# EAGLE design tweety (EAGLE 7.2.0)
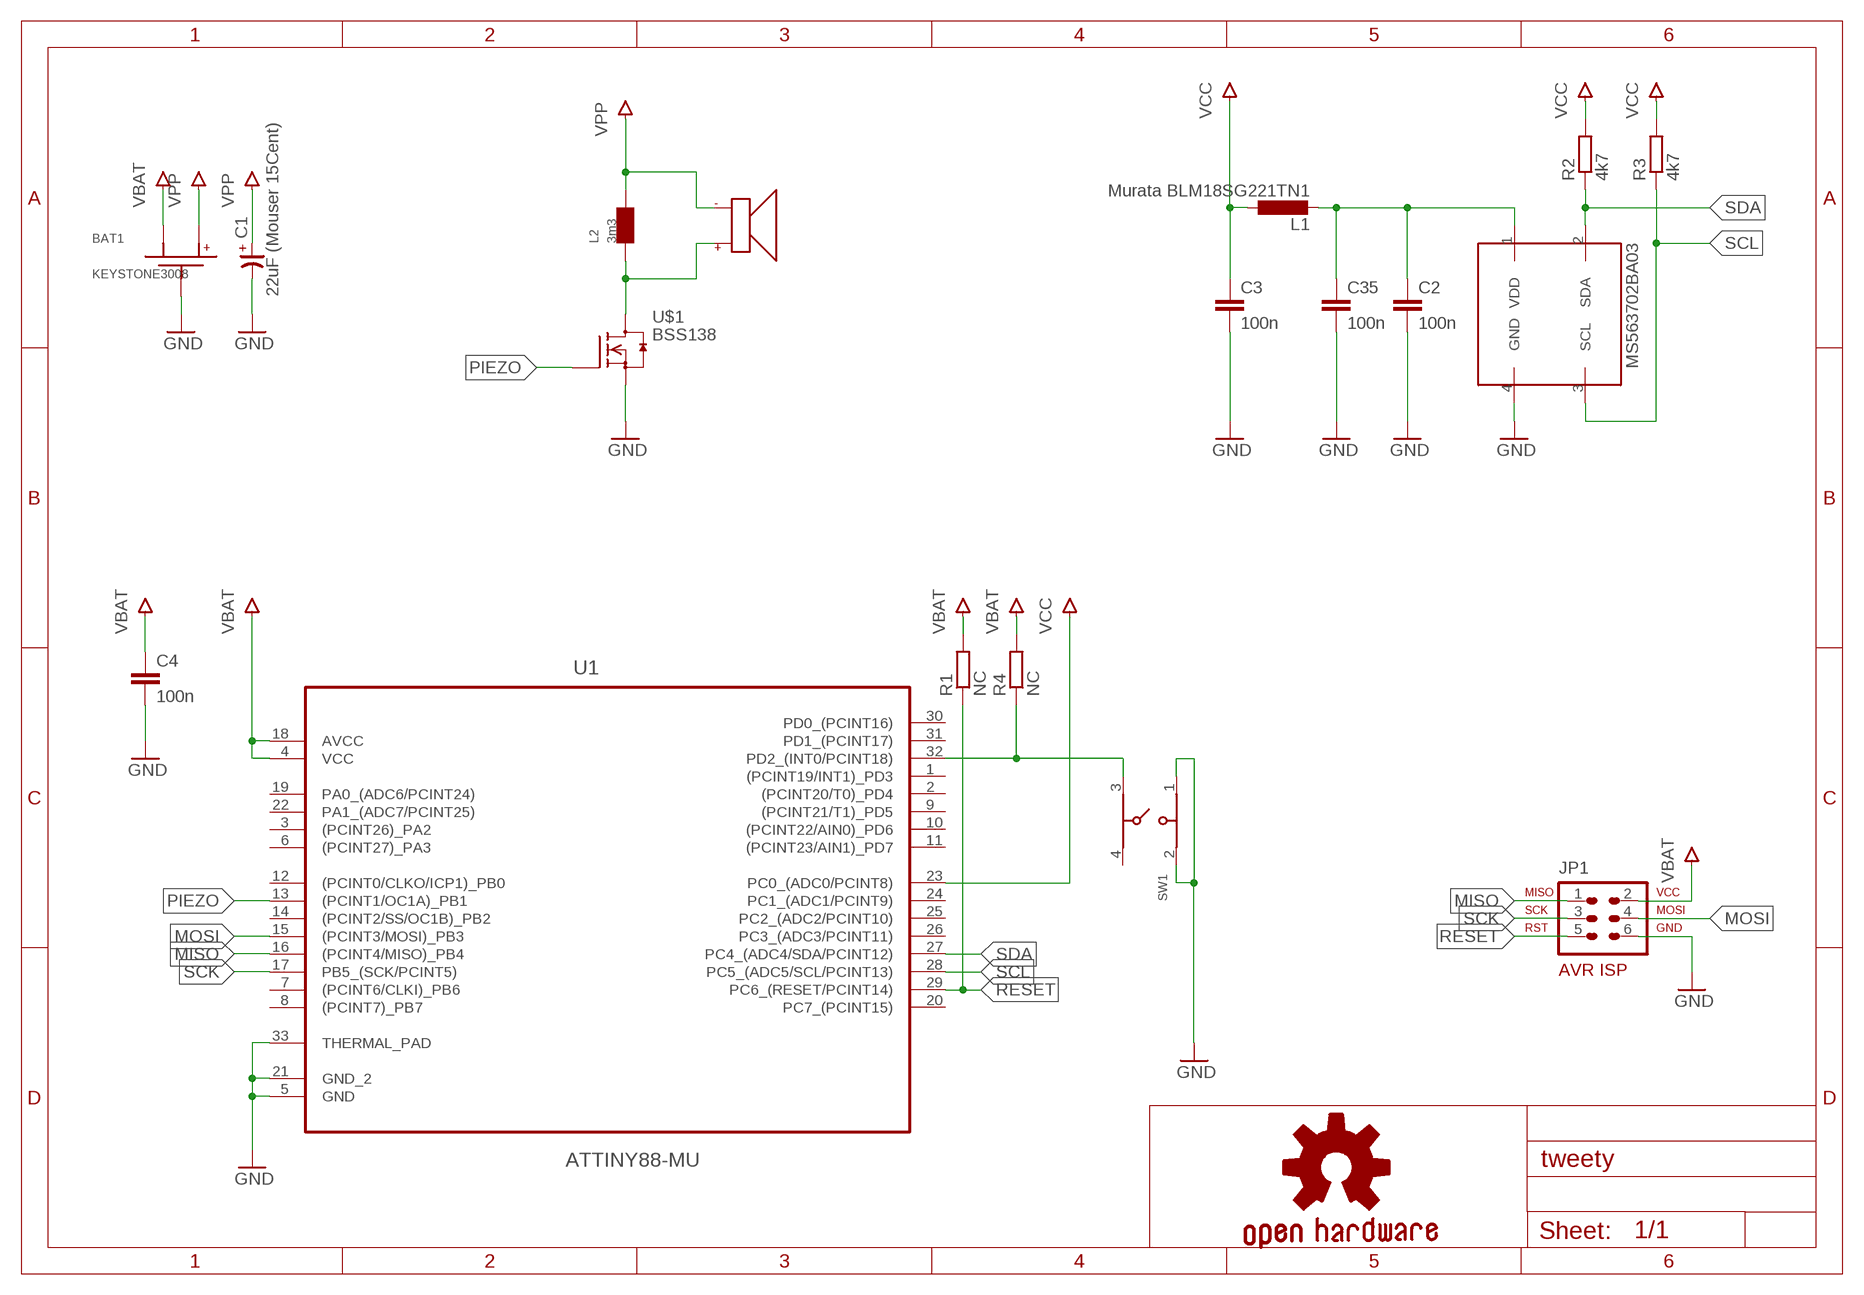
[diagram p0: schematic, sheet 1]

## Parts
BAT1  KEYSTONE3008  [KEYSTONE3008]
C1  22uF (Mouser 15Cent)  CP-3528-21R  [3528-21R/T]
C2  100n  C-EUC0603  [C0603]
C3  100n  C-EUC0603  [C0603]
C4  100n  C-EUC0603  [C0603]
C35  100n  C-EUC0603  [C0603]
GOLD_ORB_SM1  OSHWLOGO_GOLD_ORB_MED  [OSHW1]
IC2  MS563702BA03  [MS5637]
JP1  AVR-ISP-6VERT  [AVR-ISP-6]
L1  Murata BLM18SG221TN1  L-EUL0603  [L0603]
L2  3m3  SDR0503  [SDR0503]
P2  PKLCS1212E2400  [PKLCS1212]
R1  NC  R-EU_R0603  [R0603]
R2  4k7  R-EU_R0603  [R0603]
R3  4k7  R-EU_R0603  [R0603]
R4  NC  R-EU_R0603  [R0603]
SW1  4301X20858X6  [4301X20858X6]
U1  ATTINY88-MU  [QFN50P500X500X100-33N]
U$1  BSS138  [SOT23]

## Nets
GND: BAT1.N C1.- C2.2 C3.2 C4.2 C35.2 IC2.4(GND) JP1.6 SW1.1 SW1.2 U1.5(GND) U1.21(GND_2) U1.33(THERMAL_PAD) U$1.2(S)
MISO: JP1.1 U1.16((PCINT4/MISO)_PB4)
MOSI: JP1.4 U1.15((PCINT3/MOSI)_PB3)
N$1: C2.1 C35.1 IC2.1(VDD) L1.2
N$2: R4.1 SW1.3 U1.32(PD2_(INT0/PCINT18))
N$3: L2.P$1 P2.P$+ U$1.3(D)
PIEZO: U1.13((PCINT1/OC1A)_PB1) U$1.1(G)
RESET: JP1.5 R1.1 U1.29(PC6_(RESET/PCINT14))
SCK: JP1.3 U1.17(PB5_(SCK/PCINT5))
SCL: IC2.3(SCL) R3.1 U1.28(PC5_(ADC5/SCL/PCINT13))
SDA: IC2.2(SDA) R2.1 U1.27(PC4_(ADC4/SDA/PCINT12))
VBAT: BAT1.P$3(P1) C4.1 JP1.2 R1.2 R4.2 U1.4(VCC) U1.18(AVCC)
VCC: C3.1 L1.1 R2.2 R3.2 U1.23(PC0_(ADC0/PCINT8))
VPP: BAT1.P$4(P2) C1.+ L2.P$2 P2.P$-
Unconnected: SW1.4 U1.1((PCINT19/INT1)_PD3) U1.2((PCINT20/T0)_PD4) U1.3((PCINT26)_PA2) U1.6((PCINT27)_PA3) U1.7((PCINT6/CLKI)_PB6) U1.8((PCINT7)_PB7) U1.9((PCINT21/T1)_PD5) U1.10((PCINT22/AIN0)_PD6) U1.11((PCINT23/AIN1)_PD7) U1.12((PCINT0/CLKO/ICP1)_PB0) U1.14((PCINT2/SS/OC1B)_PB2) U1.19(PA0_(ADC6/PCINT24)) U1.20(PC7_(PCINT15)) U1.22(PA1_(ADC7/PCINT25)) U1.24(PC1_(ADC1/PCINT9)) U1.25(PC2_(ADC2/PCINT10)) U1.26(PC3_(ADC3/PCINT11)) U1.30(PD0_(PCINT16)) U1.31(PD1_(PCINT17))

## Library data of the parts
BAT1 = vario_spc:KEYSTONE3008
C1 = cap-master:CP-: POLARIZED CAP
C2-C4 C35 = rcl-2:C-EU: CAPACITOR, European symbol
GOLD_ORB_SM1 = bfl:OSHWLOGO: These are Open-Source Hardware logos.
IC2 = freetronics-original:MS5637
JP1 = avr-7:AVR-ISP-6: AVR ISP-6 Serial Programming Header
L1 = rcl-2:L-EU: INDUCTOR, European symbol
L2 = vario_spc:SDR0503
P2 = vario_spc:PKLCS1212E2400
R1-R4 = rcl-2:R-EU_: RESISTOR, European symbol
SW1 = EAGLE-TACT_SWITCHES-rev1:4301X20858X6: WS-TASV Tact Switch, SMD version Specification Contact Rating Switching :50mA, 12VDC Contact Resistance Initial: 100mΩ max. After life test: 2mΩ max. Insulation Resistance: min.100MΩ at 500VDC Dielectric Strength : 250VAC for 1 minute Stroke :0.3 ± 0.1mm. Bounce : 10ms max. Material Cover : : Stainless Steel Stem :PA9T UL 94 V-0. Frame :PA9T UL 94 V-0, color Black Contact : :Stainless Steel with Silver Terminal : Copper Alloy with Silver <http://katalog.we-online.de/media/images/v2/Family_WS-TASV-Gruppe.jpg> Details see: http://katalog.we-online.de/en/em/TASV_12X12_SMD 2015 (C) Wurth Elektronik
U1 = vario_spc:ATTINY88-MU: IC, 8BIT MCU, AVR Tiny, 12MHZ, QFN-32; MPN: ATTINY88-MU; OC_FARNELL: 1748549; OC_NEWARK: 68T3857; PACKAGE: QFN-32; SUPPLIER: ATMEL
U$1 = m-pad-1.5:BSS138: Fairchild Semiconductors BSS138 N-Channel Logic Level Enhancement Mode Field Effect Transistor General Description: These N-Channel enhancement mode field effect transistors are produced using Fairchild?s proprietary, high cell density, DMOS technology. These products have been designed to minimize on-state resistance while provide rugged, reliable, and fast switching performance.These products are particularly suited for low voltage, low current applications such as small servo motor control, power MOSFET gate drivers, and other switching applications. Features: 0.22 A, 50 V. RDS(ON) = 3.5? @ VGS = 10 V RDS(ON) = 6.0? @ VGS = 4.5 V High density cell design for extremely low RDS(ON) Rugged and Reliable Compact industry standard SOT-23 surface mount package Please send any comments to: messi@users.sourceforge.net

## Net classes
0 default: width 0.152 mm, drill 0.305 mm, clearance 0.152 mm

## Board
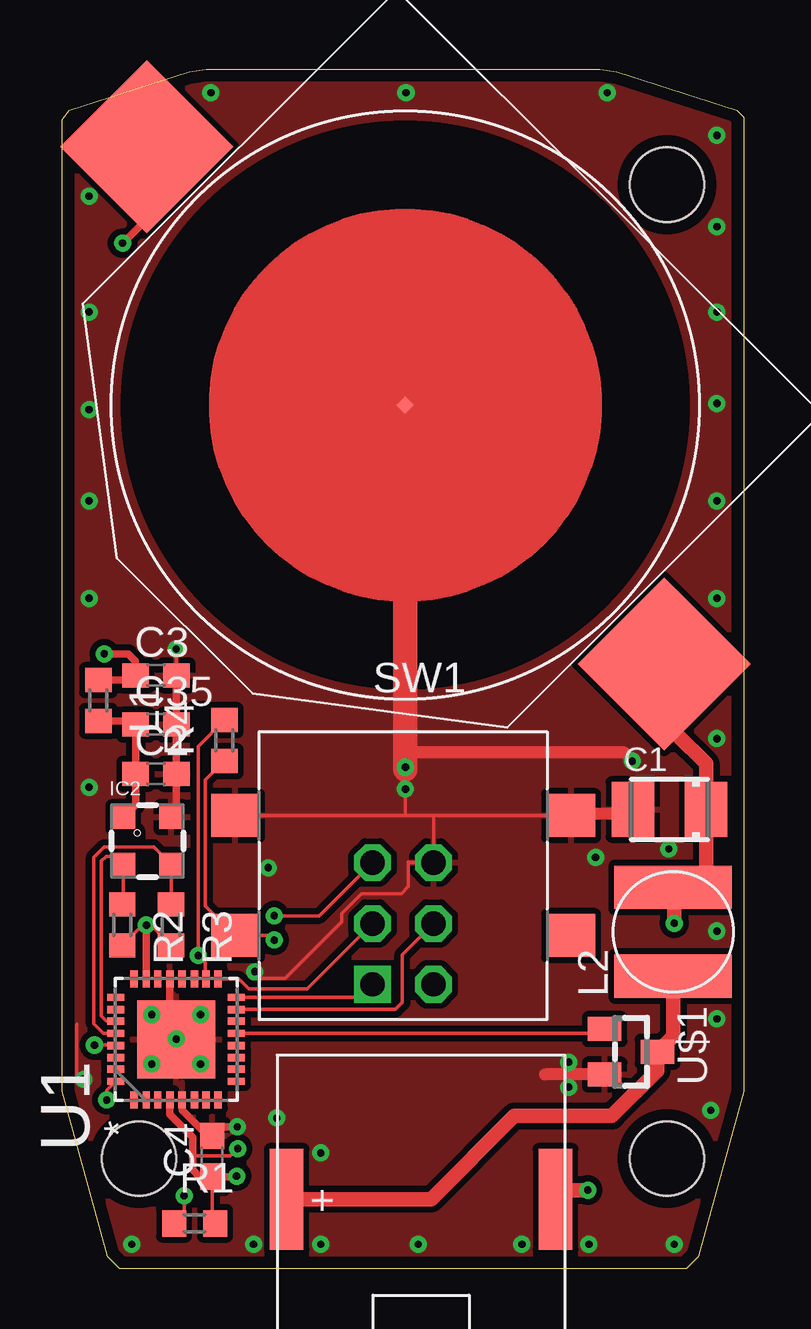
[diagram p1: board, top side]
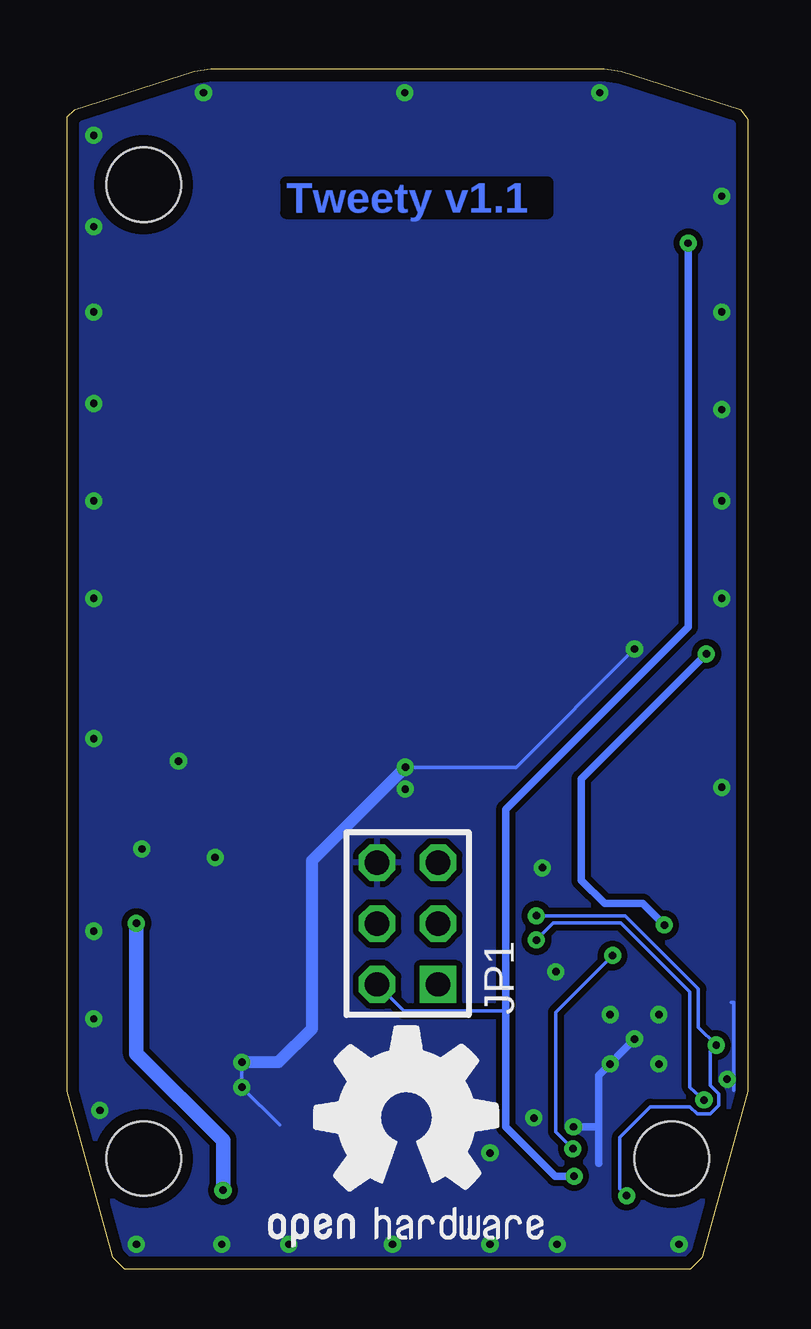
[diagram p2: board, bottom side, seen from below]

Size 28.4 x 50 mm. Coordinates in mm from the lower left corner, seen from the top.
Outline: 0.3,48.3 5.3,49.9 6,50 22.4,50 23.1,49.9 28.1,48.3 28.4,48 28.4,7.4 26.5,0.5 26,0 2.4,0 1.9,0.5 0,7.4 0,47.9 0.3,48.3
Copper layers (1*16): Top 0.035mm / dielectric 1.5mm / Bottom 0.035mm
Design rules "default *": minimum track width 6mil, minimum drill 12mil, track to track 6mil, track to pad 6mil, pad to pad 6mil, via to via 6mil, smd to smd 6mil, copper to edge 20mil, drill to drill 8mil, minimum pad ring 10mil, minimum via ring 8mil, stop-mask expansion 4mil, vias tented up to drill 14mil, thermal gap 10mil
Holes 3.1 mm at 25.2,45.2 25.2,4.6 3.2,4.6
tRestrict: area 2.7,24.4 to 25.9,47.6; 3 lines

### Footprints (pad centres in the part's own frame; a part is rotated, then mirrored left to right if it is on the bottom)
KEYSTONE3008 = smd 0.5 x 0.5: N 0,0 | smd 5.1 x 5.1: P$3 -15.25,0; P$4 15.25,0
3528-21R/T = smd 1.778 x 2.286: + 1.525,0; - -1.525,0
C0603 = smd 1.1 x 1: 1 -0.85,0; 2 0.85,0
MS5637 = smd 1 x 1: 1 -1,1; 2 -1,-1; 3 1,-1; 4 1,1
AVR-ISP-6 = drill 1.016 square: 1 -2.54,-1.27 | drill 1.016 octagon: 2 -2.54,1.27; 3 0,-1.27; 4 0,1.27; 5 2.54,-1.27; 6 2.54,1.27
L0603 = smd 1 x 1.1: 1 -0.85,0; 2 0.85,0
SDR0503 = smd 1.8 x 4.9: P$1 -1.85,0; P$2 1.85,0
PKLCS1212 = smd 1.4 x 4.2: P$+ 5.6,0; P$- -5.6,0
R0603 = smd 1 x 1.1: 1 -0.85,0; 2 0.85,0
4301X20858X6 = smd 2 x 1.8: 1 -7,2.5; 2 7,2.5; 3 -7,-2.5; 4 7,-2.5
QFN50P500X500X100-33N = smd 0.711 x 0.305: 1 -2.515,1.753; 2 -2.515,1.245; 3 -2.515,0.762; 4 -2.515,0.254; 5 -2.515,-0.254; 6 -2.515,-0.762; 7 -2.515,-1.245; 8 -2.515,-1.753; 17 2.515,-1.753; 18 2.515,-1.245; 19 2.515,-0.762; 20 2.515,-0.254; 21 2.515,0.254; 22 2.515,0.762; 23 2.515,1.245; 24 2.515,1.753 | smd 0.305 x 0.711: 9 -1.753,-2.515; 10 -1.245,-2.515; 11 -0.762,-2.515; 12 -0.254,-2.515; 13 0.254,-2.515; 14 0.762,-2.515; 15 1.245,-2.515; 16 1.753,-2.515; 25 1.753,2.515; 26 1.245,2.515; 27 0.762,2.515; 28 0.254,2.515; 29 -0.254,2.515; 30 -0.762,2.515; 31 -1.245,2.515; 32 -1.753,2.515 | smd 3.251 x 3.251: 33 0,0
SOT23 = smd 1 x 1.4: 1 -0.95,-1.1; 2 0.95,-1.1; 3 0,1.1

### Placement (x,y rotation side)
BAT1  14.29,36 315 top
C1  25.3,19.15 0 top
C2  3.9,20.64 0 top
C3  3.9,24.74 0 top
C4  6.25,4.7 90 top
C35  3.9,22.69 0 top
GOLD_ORB_SM1  20.62,-0.82 0 bottom
IC2  3.55,17.84 0 top
JP1  14.2,14.4 90 bottom
L1  1.5,23.69 270 top
L2  25.45,14.05 90 top
P2  14.95,2.91 180 top
R1  5.51,1.9 0 top
R2  2.5,14.34 270 top
R3  4.53,14.34 270 top
R4  6.76,22.02 90 top
SW1  14.2,16.4 0 top
U1  4.74,9.57 90 top
U$1  23.7,9.05 270 top

### Tracks (layer width: path | path; a pad name or v marks a point on that pad's centre or on a via)
GND  (via drill 0.3)
  Top 0.152: SW1.1 14.3,18.9 | 14.3,18.9 15.39,18.9 | 15.39,18.9 SW1.2 | 14.3,18.9 v14.3,20 v14.3,20.91 v14.29,20.91 | 15.39,18.9 15.47,18.82 JP1.6 14.44,16.94 14.42,16.96 14.42,15.94 14.12,15.64 12.47,15.64 11.65,14.83 11.65,14.47 9.29,12.11 8.3,12.11 v8.02,12.39 | C3.2 v4.75,25.84 | 0.61,10.2 0.61,7.91 v0.89,7.91
  Top 0.305: IC2.4 4.75,19.05 C2.2 C35.2 C3.2 | U1.21 4.49,9.82 U1.33 | v7.29,5.93 6.63,5.93 C4.2 6.06,5.55 4.99,6.62 U1.5
  Top 0.508: 23.43,21.52 14.35,21.52 | 14.35,21.52 14.29,21.52 | v14.29,20.91 14.29,21.47 14.35,21.52 | U$1.2 20.12,8.1 | 21.13,18.99 23.67,18.99
  Top 1.016: BAT1.N 14.29,21.52 v14.29,20.91 14.29,20.82 14.3,20.81
  Bottom 0.152: v4.75,25.84 9.67,20.91 v14.29,20.91 | v21.1,8.62 v21.1,7.58 19.52,6 | 0.71,11.11 0.61,11.11 0.61,7.63 | 0.61,7.45 0.61,7.63 | 0.61,7.63 v0.89,7.91
  Bottom 0.305: 6.24,5.93 6.24,8.06 U1.33 v4.75,9.59 | 6.24,5.93 6.24,4.4 | v7.29,5.93 6.24,5.93
  Bottom 0.508: v14.29,20.91 18.18,17.02 18.18,10.02 19.58,8.62 v21.1,8.62
  other vias: 3.73,10.6 3.73,8.54 5.76,10.6 5.76,8.54 2.89,1.03 10.77,1.03 14.83,1.03 19.15,1.03 21.94,1.03 25.5,1.03 27.02,6.61 27.28,10.42 27.28,27.95 27.28,32.01 27.28,36.08 27.28,39.89 27.28,43.44 27.28,47.25 22.7,49.03 6.19,49.03 14.32,49.03 1.11,44.71 1.11,39.89 1.11,35.82 1.11,32.01 1.11,27.95 1.11,20.08 27.28,22.11 7.97,1.03 10.77,4.84 8.94,6.29 22.22,17.16 23.75,21.17 25.27,17.51 27.28,14.08 8.58,16.72
  pour Bottom (isolate 0.254): 0.2,49.72 0.2,0.19 28.14,0.19 28.14,49.72
  pour Top (isolate 0.254): 0.2,49.72 0.2,0.19 28.14,0.19 28.14,49.72
MISO
  Top 0.152: U1.16 12.39,11.32 JP1.1
MOSI
  Top 0.152: U1.15 13.87,10.81 14.17,11.11 14.17,13.1 JP1.4
N$1
  Top 0.305: L1.2 2.9,22.84 C35.1 C2.1 3.05,19.35 IC2.1
N$2  (via drill 0.3)
  Top 0.152: R4.1 5.97,20.38 5.97,15.13 SW1.3 8.64,13.9 v8.83,13.71 | U1.32 1.85,7.44 v1.85,7.05
  Bottom 0.152: v1.85,7.05 2.44,7.58 2.44,11.54 5.31,14.42 8.12,14.42 v8.83,13.71
N$3
  Top 0.508: 24.79,8.94 U$1.3 | P2.P$+
  Top 0.61: P2.P$+ 15.36,2.91 18.83,6.38 22.9,6.38 24.79,8.26 24.79,8.94 | L2.P$1 25.45,9.71 U$1.3
PIEZO
  Top 0.152: U1.13 22.52,9.82 U$1.1
RESET  (via drill 0.3)
  Top 0.152: U1.29 2.21,9.33 v1.34,9.33 | R1.1 5.08,2.31 v5.08,3.06 | v8.83,14.72 10.71,14.72 JP1.5
  Bottom 0.152: v5.08,3.06 5.36,3.34 5.36,5.5 4.09,6.77 2.44,6.77 2.13,6.46 1.6,6.46 1.24,6.82 1.24,7.3 1.6,7.66 1.6,9.08 v1.34,9.33 2.08,10.07 2.08,11.67 5.14,14.72 v8.83,14.72
SCK
  Top 0.152: JP1.3 10.21,11.68 7.77,11.68 7.36,12.08 U1.17
SCL
  Top 0.152: U1.28 1.71,9.82 1.32,10.22 1.32,17.16 1.75,17.59 3.8,17.59 IC2.3 4.55,15.21 R3.1
SDA
  Top 0.152: U1.27 1.84,10.33 1.62,10.55 1.62,17 1.83,17.21 2.18,17.21 IC2.2 2.55,15.24 R2.1
VBAT  (via drill 0.3)
  Top 0.152: R4.2 5.66,21.78 v5.66,13.07 5.97,12.76 5.97,12.1 U1.18 | 6.25,3.95 C4.1 6.25,2.01 R1.2 | v7.31,5.01 7.01,4.71 5.43,4.71
  Top 0.305: BAT1.P$3 3.51,43.76 v2.51,42.76 | U1.4 4.49,6.44 5.43,5.5 5.43,4.71 5.43,4.12 5.71,3.85 C4.1 7.24,3.85 v7.26,3.87
  Bottom 0.152: JP1.2 14.36,10.75 10.13,10.75 10.11,10.73 | v5.66,13.07 8.02,10.7 8.02,5.72 v7.31,5.01
  Bottom 0.305: v2.51,42.76 2.51,26.76 10.11,19.16 10.11,10.73 10.11,5.93 8.05,3.87 v7.26,3.87
VCC  (via drill 0.3)
  Top 0.152: 3.49,14.33 3.33,14.33 R2.2 | v3.5,14.34 3.69,14.34 R3.2
  Top 0.305: U1.23 3.49,14.33 v3.5,14.34 | L1.1 2.85,24.54 C3.1 3.04,25.33 2.74,25.64 v1.75,25.64
  Bottom 0.305: v1.75,25.64 6.96,20.43 6.96,16.2 5.99,15.23 4.4,15.23 v3.5,14.34
VPP  (via drill 0.3)
  Top 0.508: 26.75,15.65 26.51,15.65 | P2.P$- 20.17,3.29 | 25.5,15.65 L2.P$2 | 25.6,22.29 25.6,24.7 BAT1.P$4
  Top 0.61: L2.P$2 26.51,15.65 26.83,15.96 C1.+ 26.83,21.06 25.6,22.29 | 20.17,3.29 v21.89,3.29 | v25.5,14.41 25.5,15.65
  Bottom 0.61: v21.89,3.29 21.89,5.37 25.5,8.98 v25.5,14.41

### Text on the board
Bottom: Tweety v1.1